# Altium schematic sheet COVER PAGE.SchDoc: USB-ETH
size A3; Author: Luca Schenetti; DrawnBy: Luca Schenetti; Revision: C; SheetNumber: 1; SheetTotal: 4; Material: JLC04161H-3313
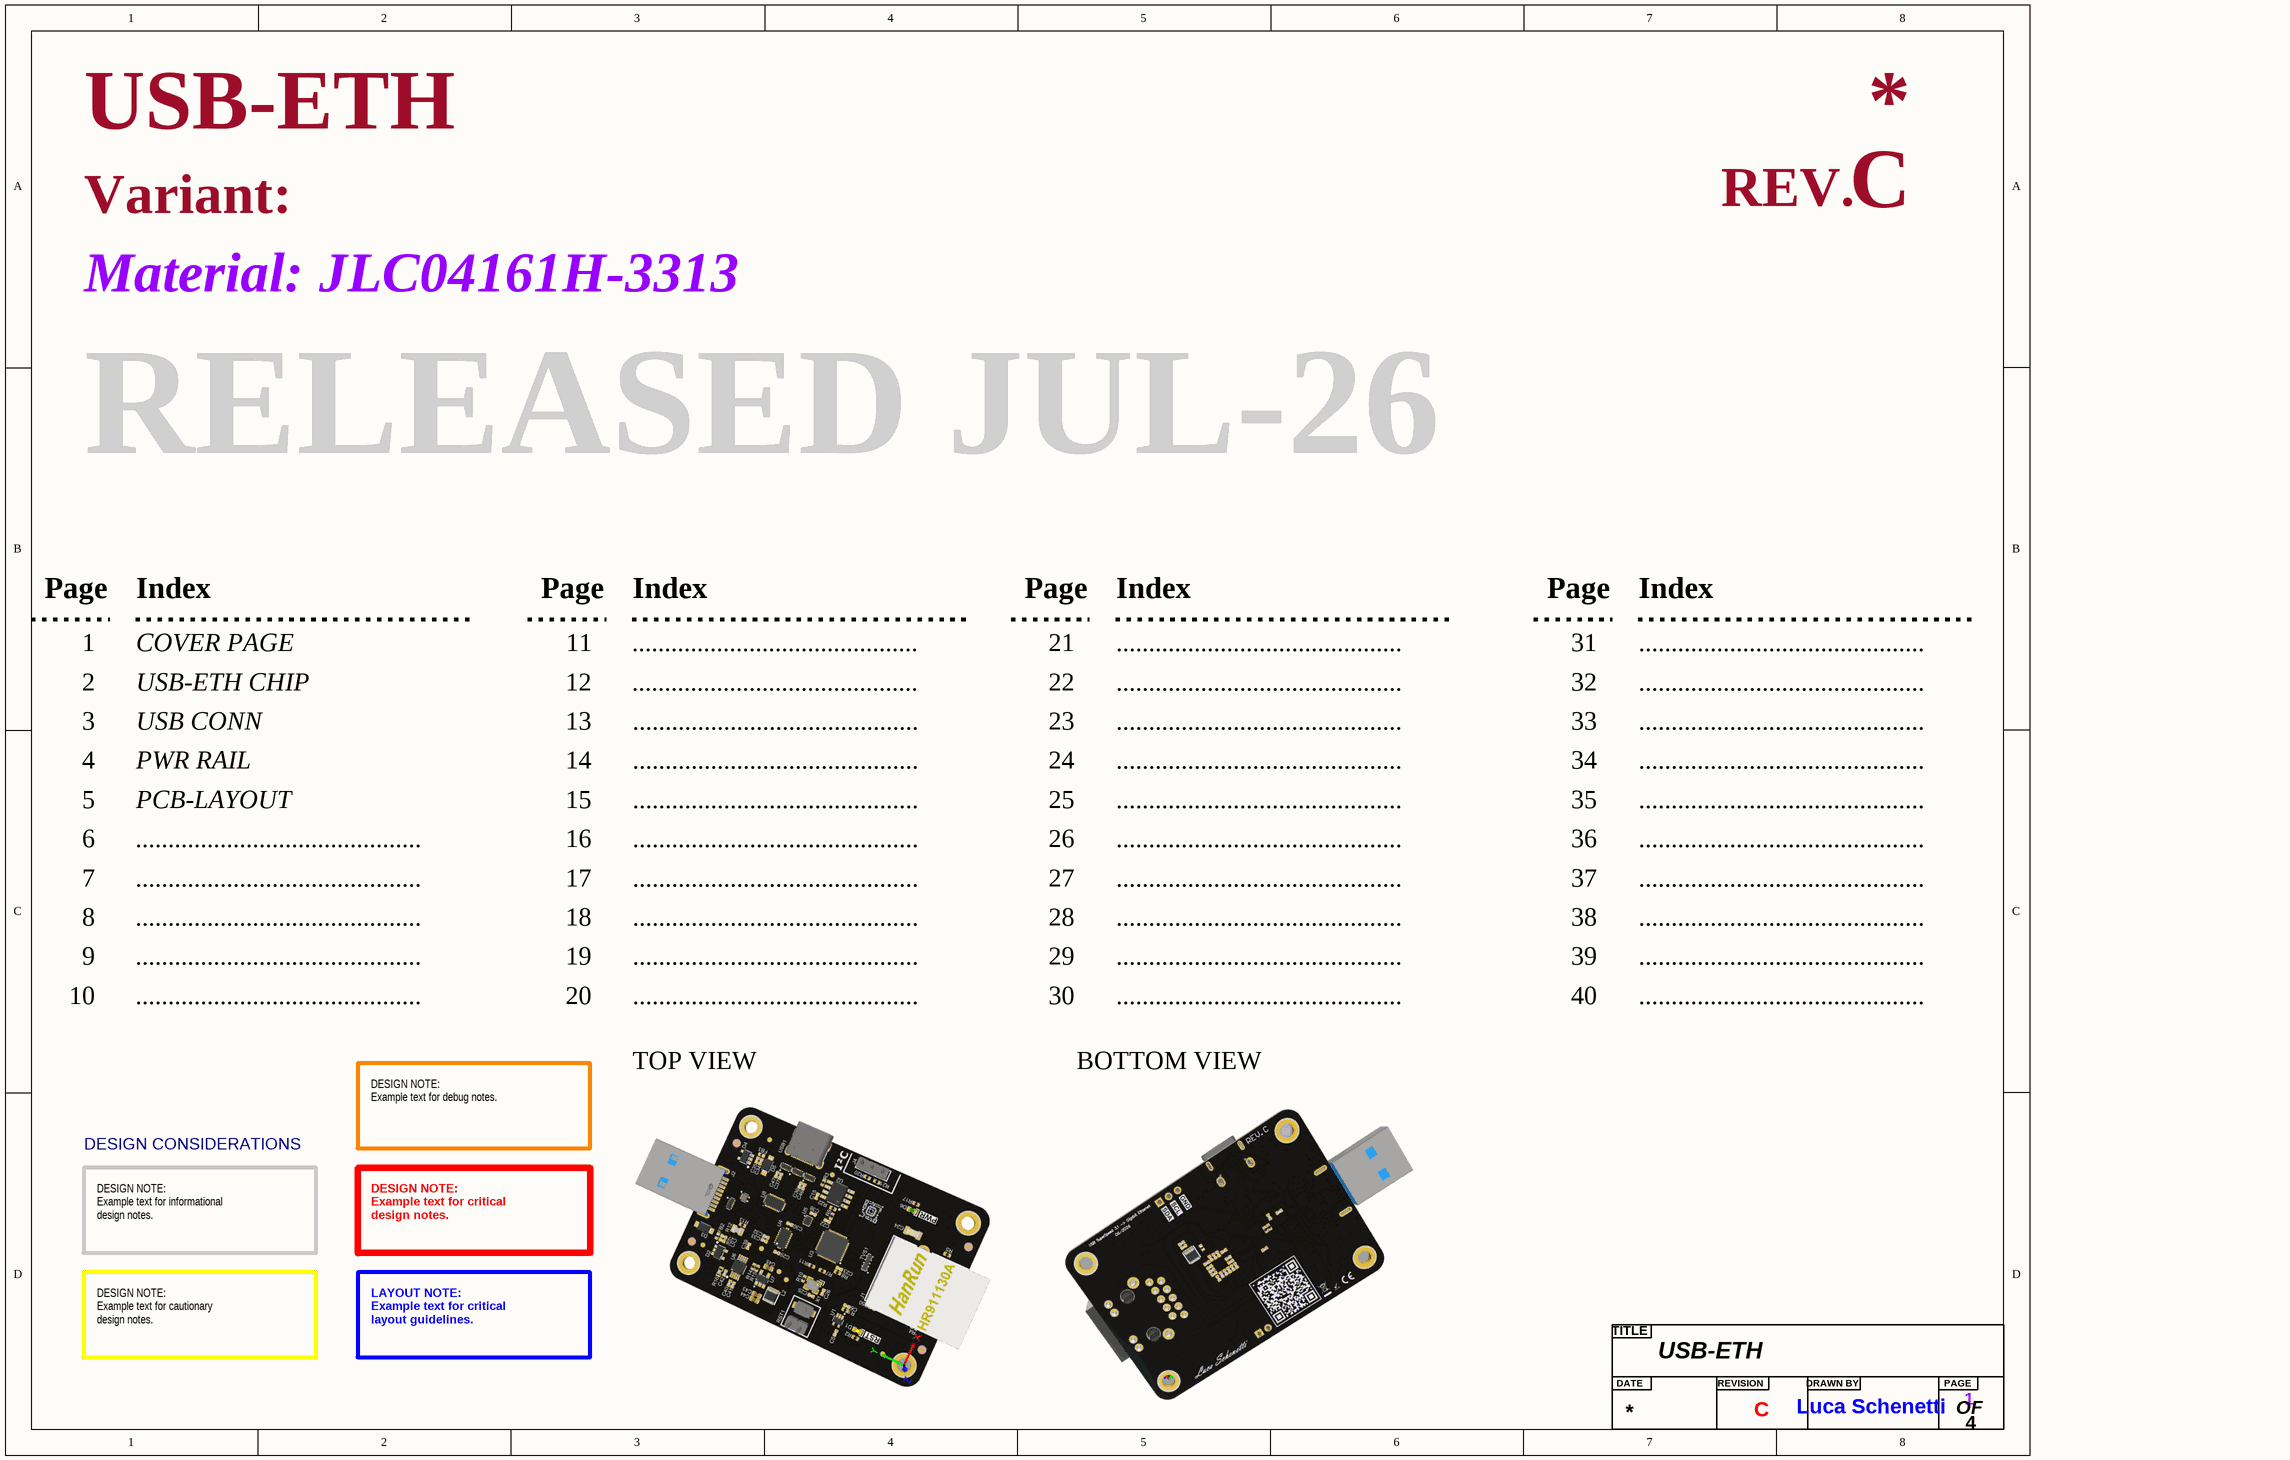
[diagram p0: COVER PAGE.SchDoc]

## Parts
?  Title  (value not drawn)  (graphical)

## Notes on the sheet
- Variant:
- REV.
- Material:
- RELEASED JUL-26
- Page
- Index
- 1
- 2
- COVER PAGE
- USB-ETH CHIP
- 11
- 12
- ............................................
- 21
- 22
- 31
- 32
- 3
- USB CONN
- 13
- 23
- 33
- 4
- 5
- PWR RAIL
- PCB-LAYOUT
- 14
- 15
- 24
- 25
- 34
- 35
- 6
- 7
- 16
- 17
- 26
- 27
- 36
- 37
- 8
- 18
- 28
- 38
- 9
- 10
- 19
- 20
- 29
- 30
- 39
- 40
- TOP VIEW
- BOTTOM VIEW
- DESIGN CONSIDERATIONS
- DESIGN NOTE:
  Example text for debug notes.
- DESIGN NOTE:
  Example text for informational
  design notes.
- DESIGN NOTE:
  Example text for critical
  design notes.
- DESIGN NOTE:
  Example text for cautionary
  design notes.
- LAYOUT NOTE:
  Example text for critical
  layout guidelines.
- (in symbol Title) TITLE; DATE; REVISION; DRAWN BY; PAGE; OF